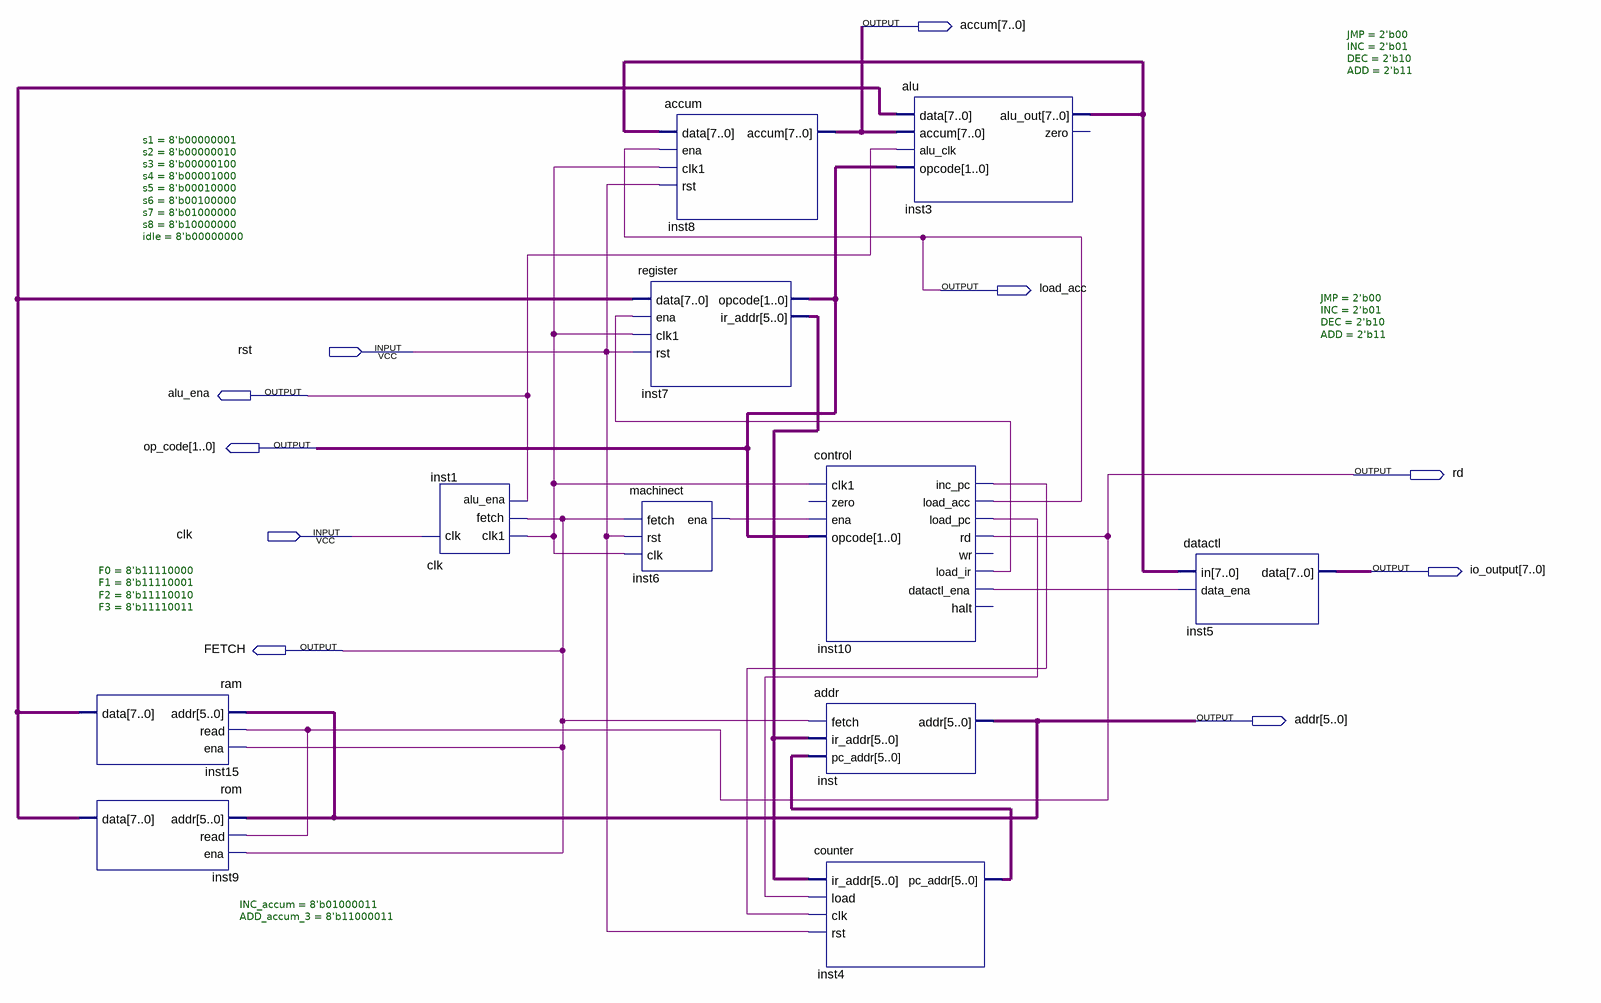
[diagram p0: schematic sheet]
// Quartus schematic CPU.bdf as structural Verilog: 11 symbols, 10 pins
module CPU (
  input  rst,
  input  clk,
  output [7:0] accum,
  output load_acc,
  output alu_ena,
  output [1:0] op_code,
  output rd,
  output [7:0] io_output,
  output FETCH,
  output [5:0] addr
);

  wire inst1_clk1, inst6_ena, inst10_datactl_ena, inst10_inc_pc, inst10_load_ir, inst10_load_pc;
  wire [5:0] inst4_pc_addr, inst7_ir_addr;
  wire [7:0] inst3_alu_out, inst15_data;

  ram #(.F0(8'b11110000), .F1(8'b11110001), .F2(8'b11110010), .F3(8'b11110011)) inst15 (
    .addr(addr), .read(rd), .ena(FETCH), .data(inst15_data));
  rom #(.INC_accum(8'b01000011), .ADD_accum_3(8'b11000011)) inst9 (
    .addr(addr), .read(rd), .ena(FETCH), .data(inst15_data));
  clk #(.s1(8'b00000001), .s2(8'b00000010), .s3(8'b00000100), .s4(8'b00001000), .s5(8'b00010000), .s6(8'b00100000), .s7(8'b01000000), .s8(8'b10000000), .idle(8'b00000000)) inst1 (
    .clk(clk), .clk1(inst1_clk1), .fetch(FETCH), .alu_ena(alu_ena));
  machinect inst6 (.fetch(FETCH), .rst(rst), .clk(inst1_clk1), .ena(inst6_ena));
  accum inst8 (.data(inst3_alu_out), .ena(load_acc), .clk1(inst1_clk1), .rst(rst), .accum(accum));
  register inst7 (
    .data(inst15_data), .ena(inst10_load_ir), .clk1(inst1_clk1), .rst(rst), .opcode(op_code),
    .ir_addr(inst7_ir_addr));
  control #(.JMP(2'b00), .INC(2'b01), .DEC(2'b10), .ADD(2'b11)) inst10 (
    .clk1(inst1_clk1), .ena(inst6_ena), .opcode(op_code), .inc_pc(inst10_inc_pc), .load_acc(load_acc),
    .load_pc(inst10_load_pc), .rd(rd), .load_ir(inst10_load_ir), .datactl_ena(inst10_datactl_ena));  // open: zero, wr, halt
  addr inst (.fetch(FETCH), .ir_addr(inst7_ir_addr), .pc_addr(inst4_pc_addr), .addr(addr));
  counter inst4 (
    .ir_addr(inst7_ir_addr), .load(inst10_load_pc), .clk(inst10_inc_pc), .rst(rst), .pc_addr(inst4_pc_addr));
  alu #(.JMP(2'b00), .INC(2'b01), .DEC(2'b10), .ADD(2'b11)) inst3 (
    .data(inst15_data), .accum(accum), .alu_clk(alu_ena), .opcode(op_code), .alu_out(inst3_alu_out));  // open: zero
  datactl inst5 (.in(inst3_alu_out), .data_ena(inst10_datactl_ena), .data(io_output));
endmodule
